# Altium schematic sheet Component Switch.SchDoc
size A3; SheetNumber: 1; SheetTotal: 1
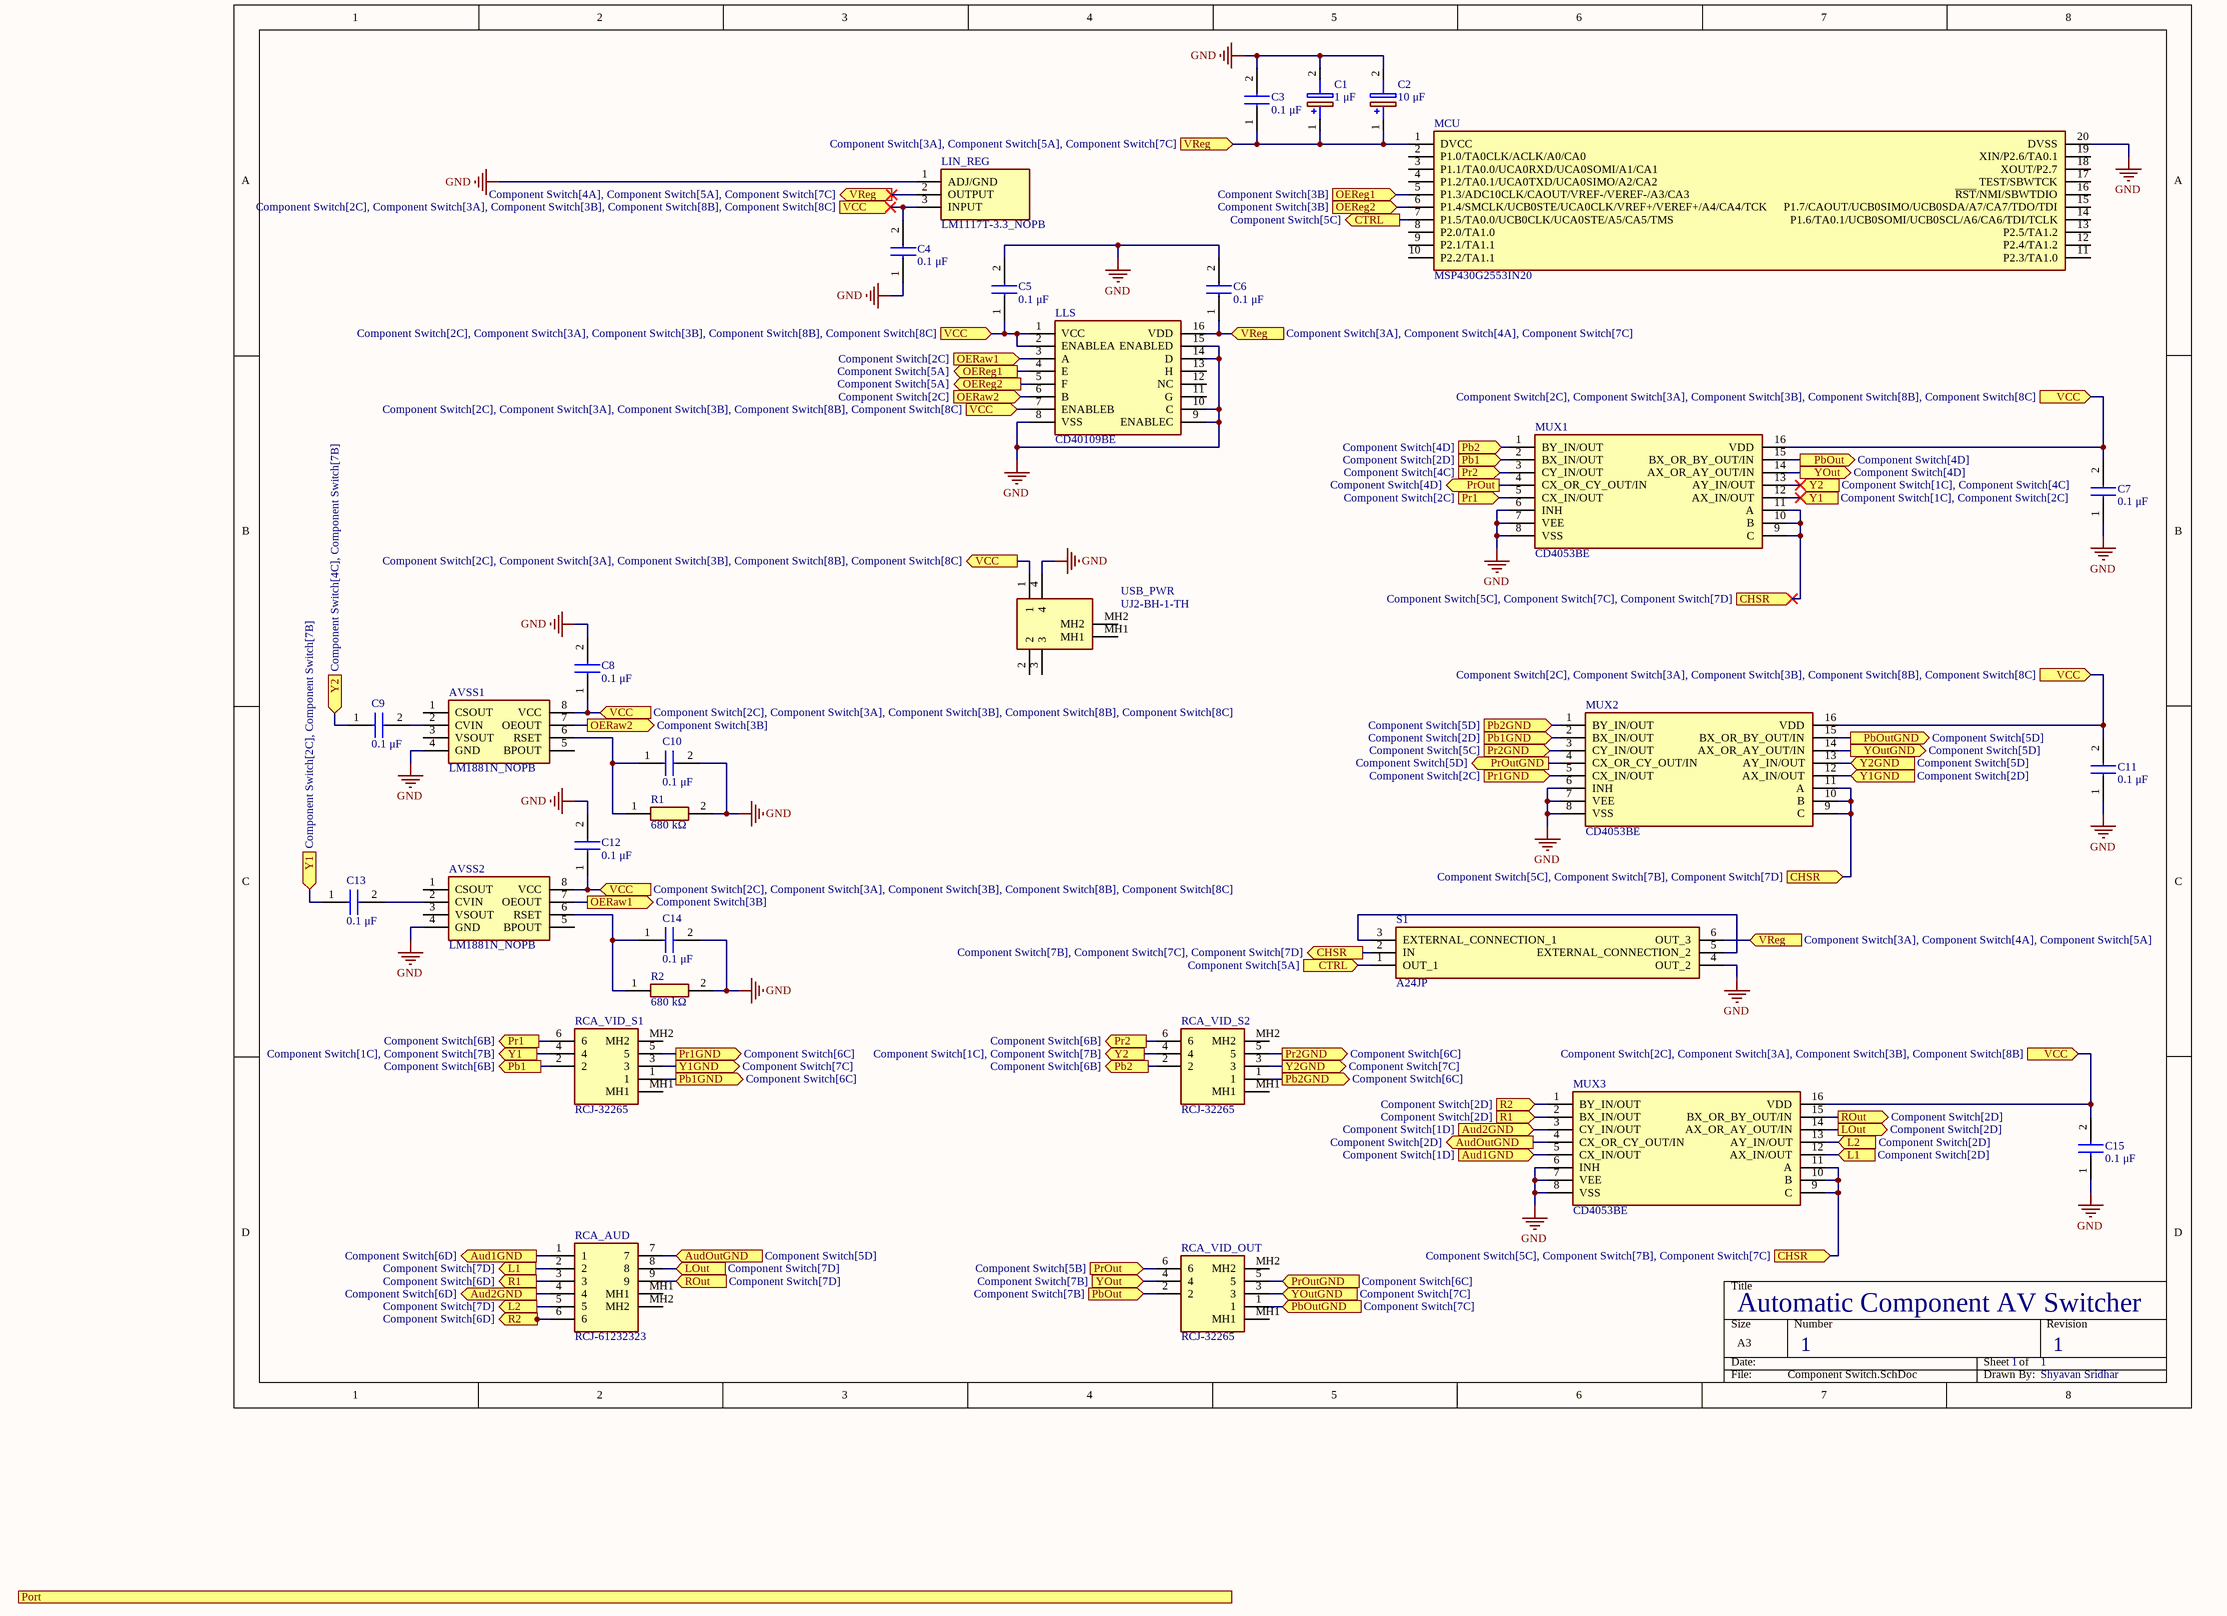
[diagram p0: Component Switch.SchDoc]

## Parts
AVSS1  LM1881N_NOPB  [DIP794W53P254L959H508Q8N]
AVSS2  LM1881N_NOPB  [DIP794W53P254L959H508Q8N]
C1  1 μF  [CAPPRD200W52D500H1250]
C2  10 μF  [CAPPRD200W52D500H1250]
C3  0.1 μF  [C320C104K5R5TA]
C4  0.1 μF  [C320C104K5R5TA]
C5  0.1 μF  [C320C104K5R5TA]
C6  0.1 μF  [C320C104K5R5TA]
C7  0.1 μF  [C320C104K5R5TA]
C8  0.1 μF  [C320C104K5R5TA]
C9  0.1 μF  [C320C104K5R5TA]
C10  0.1 μF  [C320C104K5R5TA]
C11  0.1 μF  [C320C104K5R5TA]
C12  0.1 μF  [C320C104K5R5TA]
C13  0.1 μF  [C320C104K5R5TA]
C14  0.1 μF  [C320C104K5R5TA]
C15  0.1 μF  [C320C104K5R5TA]
LIN_REG  LM1117T-3.3_NOPB  [TO254P470X1028X1955-3P]
LLS  CD40109BE  [DIP794W53P254L1930H508Q16N]
MCU  MSP430G2553IN20  [DIP794W53P254L2540H508Q20N]
MUX1  CD4053BE  [DIP794W53P254L1930H508Q16N]
MUX2  CD4053BE  [DIP794W53P254L1930H508Q16N]
MUX3  CD4053BE  [DIP794W53P254L1930H508Q16N]
R1  680 kΩ  [RESAD1520W63L600D230]
R2  680 kΩ  [RESAD1520W63L600D230]
RCA_AUD  RCJ-61232323  [RCJ61232323]
RCA_VID_OUT  RCJ-32265  [RCJ32265]
RCA_VID_S1  RCJ-32265  [RCJ32265]
RCA_VID_S2  RCJ-32265  [RCJ32265]
S1  A24JP  [A24JP]
USB_PWR  UJ2-BH-1-TH  [UJ2BH1TH]

## Ports
Aud1GND (in, see Component Switch[1D]), Aud1GND (out, see Component Switch[6D]), Aud2GND (in, see Component Switch[1D]), Aud2GND (out, see Component Switch[6D]), AudOutGND (in, see Component Switch[5D]), AudOutGND (out, see Component Switch[2D]), CHSR (in, see Component Switch[5C], Component Switch[7B], Component Switch[7C]), CHSR (in, see Component Switch[5C], Component Switch[7B], Component Switch[7D]), CHSR (in, see Component Switch[5C], Component Switch[7C], Component Switch[7D]), CHSR (out, see Component Switch[7B], Component Switch[7C], Component Switch[7D]), CTRL (in, see Component Switch[5A]), CTRL (out, see Component Switch[5C]), L1 (in, see Component Switch[2D]), L1 (out, see Component Switch[7D]), L2 (in, see Component Switch[2D]), L2 (out, see Component Switch[7D]), LOut (in, see Component Switch[7D]), LOut (out, see Component Switch[2D]), OERaw1 (in, see Component Switch[2C]), OERaw1 (out, see Component Switch[3B]), OERaw2 (in, see Component Switch[2C]), OERaw2 (out, see Component Switch[3B]), OEReg1 (in, see Component Switch[3B]), OEReg1 (out, see Component Switch[5A]), OEReg2 (in, see Component Switch[3B]), OEReg2 (out, see Component Switch[5A]), Pb1 (in, see Component Switch[2D]), Pb1 (out, see Component Switch[6B]), Pb1GND (in, see Component Switch[2D]), Pb1GND (out, see Component Switch[6C]), Pb2 (in, see Component Switch[4D]), Pb2 (out, see Component Switch[6B]), Pb2GND (in, see Component Switch[5D]), Pb2GND (out, see Component Switch[6C]), PbOut (in, see Component Switch[7B]), PbOut (out, see Component Switch[4D]), PbOutGND (in, see Component Switch[7C]), PbOutGND (out, see Component Switch[5D]), Port, Pr1 (in, see Component Switch[2C]), Pr1 (out, see Component Switch[6B]), Pr1GND (in, see Component Switch[2C]), Pr1GND (out, see Component Switch[6C]), Pr2 (in, see Component Switch[4C]), Pr2 (out, see Component Switch[6B]), Pr2GND (in, see Component Switch[5C]), Pr2GND (out, see Component Switch[6C]), PrOut (in, see Component Switch[5B]), PrOut (out, see Component Switch[4D]), PrOutGND (in, see Component Switch[6C]), PrOutGND (out, see Component Switch[5D]), R1 (in, see Component Switch[2D]), R1 (out, see Component Switch[6D]), R2 (in, see Component Switch[2D]), R2 (out, see Component Switch[6D]), ROut (in, see Component Switch[7D]), ROut (out, see Component Switch[2D]), VCC (in, see Component Switch[2C], Component Switch[3A], Component Switch[3B], Component Switch[8B]), VCC (in, see Component Switch[2C], Component Switch[3A], Component Switch[3B], Component Switch[8B], Component Switch[8C]), VCC (out, see Component Switch[2C], Component Switch[3A], Component Switch[3B], Component Switch[8B], Component Switch[8C]), VReg (in, see Component Switch[3A], Component Switch[4A], Component Switch[5A]), VReg (in, see Component Switch[3A], Component Switch[4A], Component Switch[7C]), VReg (in, see Component Switch[3A], Component Switch[5A], Component Switch[7C]), VReg (out, see Component Switch[4A], Component Switch[5A], Component Switch[7C]), Y1 (in, see Component Switch[1C], Component Switch[2C]), Y1 (in, see Component Switch[2C], Component Switch[7B]), Y1 (out, see Component Switch[1C], Component Switch[7B]), Y1GND (in, see Component Switch[2D]), Y1GND (out, see Component Switch[7C]), Y2 (in, see Component Switch[1C], Component Switch[4C]), Y2 (in, see Component Switch[4C], Component Switch[7B]), Y2 (out, see Component Switch[1C], Component Switch[7B]), Y2GND (in, see Component Switch[5D]), Y2GND (out, see Component Switch[7C]), YOut (in, see Component Switch[7B]), YOut (out, see Component Switch[4D]), YOutGND (in, see Component Switch[7C]), YOutGND (out, see Component Switch[5D])

## Nets
GND: AVSS1.4(GND) AVSS2.4(GND) C1.2(-) C2.2(-) C3.2 C4.1 C5.2 C6.2 C7.1 C8.2 C10.2 C11.1 C12.2 C14.2 C15.1 LIN_REG.1(ADJ/GND) LLS.8(VSS) LLS.9(ENABLEC) LLS.10(C) LLS.14(D) LLS.15(ENABLED) MCU.20(DVSS) MUX1.6(INH) MUX1.7(VEE) MUX1.8(VSS) MUX2.6(INH) MUX2.7(VEE) MUX2.8(VSS) MUX3.6(INH) MUX3.7(VEE) MUX3.8(VSS) R1.2 R2.2 S1.4(OUT_2) USB_PWR.4
Aud1GND: MUX3.5(CX_IN/OUT) RCA_AUD.1 ; port Aud1GND
Aud2GND: MUX3.3(CY_IN/OUT) RCA_AUD.4 ; port Aud2GND
AudOutGND: MUX3.4(CX_OR_CY_OUT/IN) RCA_AUD.7 ; port AudOutGND
CHSR: MUX1.9(C) MUX1.10(B) MUX1.11(A) MUX2.9(C) MUX2.10(B) MUX2.11(A) MUX3.9(C) MUX3.10(B) MUX3.11(A) S1.2(IN) ; port CHSR
CTRL: MCU.7(P1.5/TA0.0/UCB0CLK/UCA0STE/A5/CA5/TMS) S1.1(OUT_1) ; port CTRL
L1: MUX3.12(AX_IN/OUT) RCA_AUD.2 ; port L1
L2: MUX3.13(AY_IN/OUT) RCA_AUD.5 ; port L2
LOut: MUX3.14(AX_OR_AY_OUT/IN) RCA_AUD.8 ; port LOut
OERaw1: AVSS2.7(OEOUT) LLS.3(A) ; port OERaw1
OERaw2: AVSS1.7(OEOUT) LLS.6(B) ; port OERaw2
OEReg1: LLS.4(E) MCU.5(P1.3/ADC10CLK/CAOUT/VREF-/VEREF-/A3/CA3) ; port OEReg1
OEReg2: LLS.5(F) MCU.6(P1.4/SMCLK/UCB0STE/UCA0CLK/VREF+/VEREF+/A4/CA4/TCK) ; port OEReg2
Pb1: MUX1.2(BX_IN/OUT) RCA_VID_S1.2 ; port Pb1
Pb1GND: MUX2.2(BX_IN/OUT) RCA_VID_S1.1 ; port Pb1GND
Pb2: MUX1.1(BY_IN/OUT) RCA_VID_S2.2 ; port Pb2
Pb2GND: MUX2.1(BY_IN/OUT) RCA_VID_S2.1 ; port Pb2GND
PbOut: MUX1.15(BX_OR_BY_OUT/IN) RCA_VID_OUT.2 ; port PbOut
PbOutGND: MUX2.15(BX_OR_BY_OUT/IN) RCA_VID_OUT.1 ; port PbOutGND
Pr1: MUX1.5(CX_IN/OUT) RCA_VID_S1.6 ; port Pr1
Pr1GND: MUX2.5(CX_IN/OUT) RCA_VID_S1.5 ; port Pr1GND
Pr2: MUX1.3(CY_IN/OUT) RCA_VID_S2.6 ; port Pr2
Pr2GND: MUX2.3(CY_IN/OUT) RCA_VID_S2.5 ; port Pr2GND
PrOut: MUX1.4(CX_OR_CY_OUT/IN) RCA_VID_OUT.6 ; port PrOut
PrOutGND: MUX2.4(CX_OR_CY_OUT/IN) RCA_VID_OUT.5 ; port PrOutGND
R1: MUX3.2(BX_IN/OUT) RCA_AUD.3 ; port R1
R2: MUX3.1(BY_IN/OUT) RCA_AUD.6 ; port R2
ROut: MUX3.15(BX_OR_BY_OUT/IN) RCA_AUD.9 ; port ROut
VCC: AVSS1.8(VCC) AVSS2.8(VCC) C4.2 C5.1 C7.2 C8.1 C11.2 C12.1 C15.2 LIN_REG.3(INPUT) LLS.1(VCC) LLS.2(ENABLEA) LLS.7(ENABLEB) MUX1.16(VDD) MUX2.16(VDD) MUX3.16(VDD) USB_PWR.1 ; port VCC
VReg: C1.1(+) C2.1(+) C3.1 C6.1 LIN_REG.2(OUTPUT) LLS.16(VDD) MCU.1(DVCC) S1.6(OUT_3) ; port VReg
Y1: C13.1 MUX1.12(AX_IN/OUT) RCA_VID_S1.4 ; port Y1
Y1GND: MUX2.12(AX_IN/OUT) RCA_VID_S1.3 ; port Y1GND
Y2: C9.1 MUX1.13(AY_IN/OUT) RCA_VID_S2.4 ; port Y2
Y2GND: MUX2.13(AY_IN/OUT) RCA_VID_S2.3 ; port Y2GND
YOut: MUX1.14(AX_OR_AY_OUT/IN) RCA_VID_OUT.4 ; port YOut
YOutGND: MUX2.14(AX_OR_AY_OUT/IN) RCA_VID_OUT.3 ; port YOutGND
NetAVSS1_2: AVSS1.2(CVIN) C9.2
NetAVSS1_6: AVSS1.6(RSET) C10.1 R1.1
NetAVSS2_2: AVSS2.2(CVIN) C13.2
NetAVSS2_6: AVSS2.6(RSET) C14.1 R2.1
NetS1_3: S1.3(EXTERNAL_CONNECTION_1) S1.5(EXTERNAL_CONNECTION_2)

Not connected (* = marked no-connect by the designer): AVSS1 1(CSOUT) 3(VSOUT) 5(BPOUT); AVSS2 1(CSOUT) 3(VSOUT) 5(BPOUT); LLS 11(G) 12(NC) 13(H); MCU 2(P1.0/TA0CLK/ACLK/A0/CA0) 3(P1.1/TA0.0/UCA0RXD/UCA0SOMI/A1/CA1) 4(P1.2/TA0.1/UCA0TXD/UCA0SIMO/A2/CA2) 8(P2.0/TA1.0) 9(P2.1/TA1.1) 10(P2.2/TA1.1) 11(P2.3/TA1.0) 12(P2.4/TA1.2) 13(P2.5/TA1.2) 14(P1.6/TA0.1/UCB0SOMI/UCB0SCL/A6/CA6/TDI/TCLK) 15(P1.7/CAOUT/UCB0SIMO/UCB0SDA/A7/CA7/TDO/TDI) 16(~{RST}/NMI/SBWTDIO) 17(TEST/SBWTCK) 18(XOUT/P2.7) 19(XIN/P2.6/TA0.1); RCA_AUD MH1 MH2; RCA_VID_OUT MH1 MH2; RCA_VID_S1 MH1 MH2; RCA_VID_S2 MH1 MH2; USB_PWR 2 3 MH1 MH2

## Notes on the sheet
- Automatic Component AV Switcher
- 1
- Shyavan Sridhar

## Library data of the parts
AVSS1 AVSS2 = LM1881N_NOPB: Integrated Circuit; Manufacturer_Name: Texas Instruments; Manufacturer_Part_Number: LM1881N/NOPB; Datasheet Link: http://www.ti.com/lit/gpn/lm1881; Height: 5.08mm; Mouser Part Number: 926-LM1881N/NOPB; Mouser Price/Stock: https://www.mouser.co.uk/ProductDetail/Texas-Instruments/LM1881N-NOPB?qs=X1J7HmVL2ZHE9%2FgjmcF9hQ%3D%3D; Arrow Part Number: LM1881N/NOPB; Arrow Price/Stock: https://www.arrow.com/en/products/lm1881nnopb/texas-instruments
C1 = 860020672005: Capacitor Polarised; Manufacturer_Name: Wurth Elektronik; Datasheet Link: https://componentsearchengine.com/Datasheets/2/860020672005.pdf; Height: 12.5mm; Manufacturer_Part_Number: 860020672005; Mouser Part Number: 710-860020672005; Mouser Price/Stock: https://www.mouser.co.uk/ProductDetail/Wurth-Elektronik/860020672005?qs=0KOYDY2FL29w5cS8aahRvQ%3D%3D
C2 = 860020472003: Capacitor Polarised; Manufacturer_Name: Wurth Elektronik; Datasheet Link: https://katalog.we-online.com/pbs/datasheet/860020472003.pdf; Height: 12.5mm; Manufacturer_Part_Number: 860020472003; Mouser Part Number: 710-860020472003; Mouser Price/Stock: https://www.mouser.co.uk/ProductDetail/Wurth-Elektronik/860020472003?qs=0KOYDY2FL2800BT4CoOrXQ%3D%3D
C3-C15 = C320C104K5R5TA: Capacitor; Manufacturer_Name: KEMET; Datasheet Link: https://content.kemet.com/datasheets/KEM_C1050_GOLDMAX_X7R.pdf; Height: 5.84mm; Manufacturer_Part_Number: C320C104K5R5TA; Mouser Part Number: 80-C320C104K5R; Mouser Price/Stock: https://www.mouser.co.uk/ProductDetail/KEMET/C320C104K5R5TA?qs=PmkNt%2FFLxQc4kNUCHU6a6Q%3D%3D; Arrow Part Number: C320C104K5R5TA; Arrow Price/Stock: https://www.arrow.com/en/products/c320c104k5r5ta/kemet-corporation?region=nac
LIN_REG = LM1117T-3.3_NOPB: Integrated Circuit; Manufacturer_Name: Texas Instruments; Manufacturer_Part_Number: LM1117T-3.3/NOPB; Datasheet Link: http://www.ti.com/lit/ds/symlink/lm1117.pdf; Height: 4.7mm; Mouser Part Number: 926-LM1117T-3.3/NOPB; Mouser Price/Stock: https://www.mouser.co.uk/ProductDetail/Texas-Instruments/LM1117T-3.3-NOPB?qs=X1J7HmVL2ZF7RIQB6O0mNg%3D%3D; Arrow Part Number: LM1117T-3.3/NOPB; Arrow Price/Stock: https://www.arrow.com/en/products/lm1117t-3.3nopb/texas-instruments?region=nac
LLS = CD40109BE: Integrated Circuit; Manufacturer_Name: Texas Instruments; Datasheet Link: http://www.ti.com/lit/ds/symlink/cd40109b.pdf; Height: 5.08mm; Manufacturer_Part_Number: CD40109BE; Mouser Part Number: 595-CD40109BE; Mouser Price/Stock: https://www.mouser.co.uk/ProductDetail/Texas-Instruments/CD40109BE?qs=gb35HGp1gQIrpwwQZIZgDQ%3D%3D; Arrow Part Number: CD40109BE; Arrow Price/Stock: https://www.arrow.com/en/products/cd40109be/texas-instruments?region=nac
MCU = MSP430G2553IN20: Integrated Circuit; Manufacturer_Name: Texas Instruments; Datasheet Link: http://www.ti.com/lit/ds/symlink/msp430g2553.pdf; Height: 5.08mm; Manufacturer_Part_Number: MSP430G2553IN20; Mouser Part Number: 595-MSP430G2553IN20; Mouser Price/Stock: https://www.mouser.co.uk/ProductDetail/Texas-Instruments/MSP430G2553IN20?qs=cBe3DO7yhR7KujMhn3Ev6Q%3D%3D; Arrow Part Number: MSP430G2553IN20; Arrow Price/Stock: https://www.arrow.com/en/products/msp430g2553in20/texas-instruments?region=nac
MUX1-MUX3 = CD4053BE: Integrated Circuit; Manufacturer_Name: Texas Instruments; Datasheet Link: https://www.ti.com/lit/ds/symlink/cd4053b.pdf?ts=1623146784152&ref_url=https%253A%252F%252Fwww.ti.com%252Fstore%252Fti%252Fen%252Fp%252Fproduct%252F%253Fp%253DCD4053BE; Height: 5.08mm; Manufacturer_Part_Number: CD4053BE; Mouser Part Number: 595-CD4053BE; Mouser Price/Stock: https://www.mouser.co.uk/ProductDetail/Texas-Instruments/CD4053BE?qs=7KMwW2o1%252BmR82X8HX5IMeA%3D%3D; Arrow Part Number: CD4053BE; Arrow Price/Stock: https://www.arrow.com/en/products/cd4053be/texas-instruments
R1 R2 = CF14JT680K: Resistor; Manufacturer_Name: Stackpole Electronics; Datasheet Link: https://cs.seielect.com/catalog/SEI-CF_CFM.pdf; Manufacturer_Part_Number: CF14JT680K
RCA_AUD = RCJ-61232323: Connector; Manufacturer_Name: CUI Devices; Datasheet Link: https://www.arrow.com/en/products/rcj-61232323/cui-inc; Height: 27.5mm; Manufacturer_Part_Number: RCJ-61232323; Mouser Part Number: 490-RCJ-61232323; Mouser Price/Stock: https://www.mouser.co.uk/ProductDetail/CUI-Devices/RCJ-61232323?qs=WyjlAZoYn52CEbg2zDc3Gw%3D%3D; Arrow Part Number: RCJ-61232323; Arrow Price/Stock: https://www.arrow.com/en/products/rcj-61232323/cui-devices?region=nac
RCA_VID_OUT RCA_VID_S1 RCA_VID_S2 = RCJ-32265: Connector; Manufacturer_Name: CUI Devices; Datasheet Link: https://www.mouser.com/datasheet/2/670/rcj-32xxx-1312698.pdf; Height: 19.2mm; Manufacturer_Part_Number: RCJ-32265; Mouser Part Number: 490-RCJ-32265; Mouser Price/Stock: https://www.mouser.co.uk/ProductDetail/CUI-Devices/RCJ-32265?qs=WyjlAZoYn53JfvqllxAfKg%3D%3D; Arrow Part Number: RCJ-32265; Arrow Price/Stock: https://www.arrow.com/en/products/rcj-32265/cui-devices?region=nac
S1 = A24JP: Switch; Manufacturer_Name: NKK Switches; Datasheet Link: https://www.nkkswitches.com/pdf/Atoggles.pdf; Height: 23.1mm; Manufacturer_Part_Number: A24JP; Mouser Part Number: 633-A24JP; Mouser Price/Stock: https://www.mouser.co.uk/ProductDetail/NKK-Switches/A24JP?qs=44TLCAUTxJtLIZ6%252BdaihIA%3D%3D; Arrow Part Number: A24JP; Arrow Price/Stock: https://www.arrow.com/en/products/a24jp/nkk-switches
USB_PWR = UJ2-BH-1-TH: Connector; Manufacturer_Name: CUI Devices; Datasheet Link: http://www.cui.com/product/resource/uj2-bh-th.pdf; Height: 10mm; Manufacturer_Part_Number: UJ2-BH-1-TH; Mouser Part Number: 490-UJ2-BH-1-TH; Mouser Price/Stock: https://www.mouser.co.uk/ProductDetail/CUI-Devices/UJ2-BH-1-TH?qs=5mqXD9RfOg2PqeDe959d6w%3D%3D; Arrow Part Number: UJ2-BH-1-TH; Arrow Price/Stock: https://www.arrow.com/en/products/uj2-bh-1-th/cui-devices?region=nac